# EAGLE schematic extension_board_header_xbee (EAGLE 7.1.0)
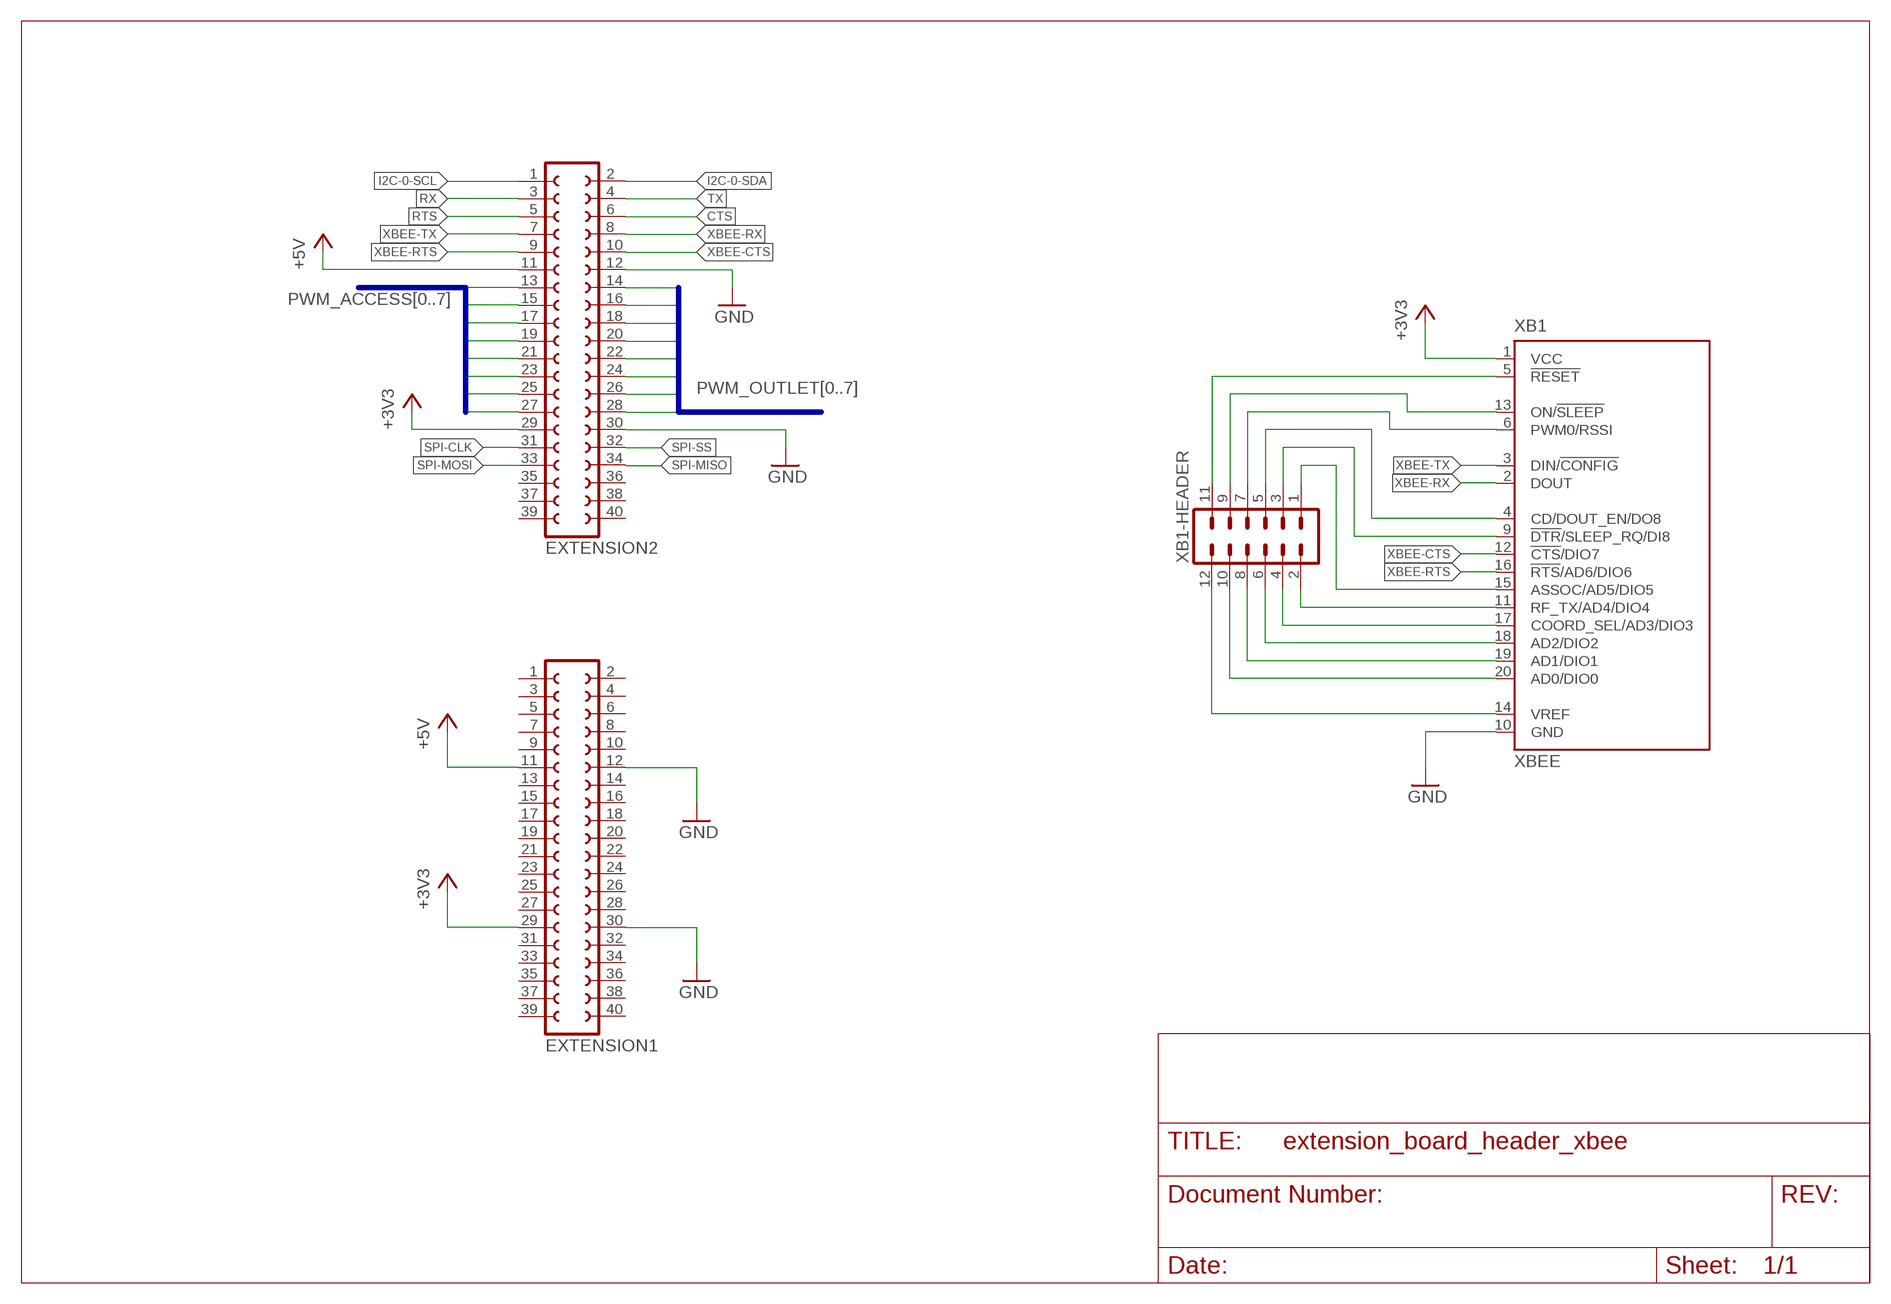
[diagram p0: schematic, sheet 1]

## Parts
EXTENSION1  FE20-2  [FE20-2]
EXTENSION2  FE20-2  [FE20-2]
XB1  XBEE  [XBEE]
XB1-HEADER  MA06-2  [MA06-2]

## Nets
+3V3: EXTENSION1.29 EXTENSION2.29 XB1.1(VCC)
+5V: EXTENSION1.11 EXTENSION2.11
CTS: EXTENSION2.6
GND: EXTENSION1.12 EXTENSION1.30 EXTENSION2.12 EXTENSION2.30 XB1.10(GND)
I2C-0-SCL: EXTENSION2.1
I2C-0-SDA: EXTENSION2.2
N$3: XB1-HEADER.12 XB1.14(VREF)
N$4: XB1-HEADER.10 XB1.20(AD0/DIO0)
N$5: XB1-HEADER.8 XB1.19(AD1/DIO1)
N$6: XB1-HEADER.6 XB1.18(AD2/DIO2)
N$7: XB1-HEADER.4 XB1.17(COORD_SEL/AD3/DIO3)
N$8: XB1-HEADER.2 XB1.11(RF_TX/AD4/DIO4)
N$9: XB1-HEADER.3 XB1.9(!DTR!/SLEEP_RQ/DI8)
N$10: XB1-HEADER.5 XB1.4(CD/DOUT_EN/DO8)
N$11: XB1-HEADER.7 XB1.6(PWM0/RSSI)
N$12: XB1-HEADER.9 XB1.13(ON/!SLEEP)
N$13: XB1-HEADER.11 XB1.5(!RESET)
N$14: XB1-HEADER.1 XB1.15(ASSOC/AD5/DIO5)
PWM_ACCESS0: EXTENSION2.13
PWM_ACCESS1: EXTENSION2.15
PWM_ACCESS2: EXTENSION2.17
PWM_ACCESS3: EXTENSION2.19
PWM_ACCESS4: EXTENSION2.21
PWM_ACCESS5: EXTENSION2.23
PWM_ACCESS6: EXTENSION2.25
PWM_ACCESS7: EXTENSION2.27
PWM_OUTLET0: EXTENSION2.14
PWM_OUTLET1: EXTENSION2.16
PWM_OUTLET2: EXTENSION2.18
PWM_OUTLET3: EXTENSION2.20
PWM_OUTLET4: EXTENSION2.22
PWM_OUTLET5: EXTENSION2.24
PWM_OUTLET6: EXTENSION2.26
PWM_OUTLET7: EXTENSION2.28
RTS: EXTENSION2.5
RX: EXTENSION2.3
SPI-CLK: EXTENSION2.31
SPI-MISO: EXTENSION2.34
SPI-MOSI: EXTENSION2.33
SPI-SS: EXTENSION2.32
TX: EXTENSION2.4
XBEE-CTS: EXTENSION2.10 XB1.12(!CTS!/DIO7)
XBEE-RTS: EXTENSION2.9 XB1.16(!RTS!/AD6/DIO6)
XBEE-RX: EXTENSION2.8 XB1.2(DOUT)
XBEE-TX: EXTENSION2.7 XB1.3(DIN/!CONFIG)
Unconnected: EXTENSION1.1 EXTENSION1.2 EXTENSION1.3 EXTENSION1.4 EXTENSION1.5 EXTENSION1.6 EXTENSION1.7 EXTENSION1.8 EXTENSION1.9 EXTENSION1.10 EXTENSION1.13 EXTENSION1.14 EXTENSION1.15 EXTENSION1.16 EXTENSION1.17 EXTENSION1.18 EXTENSION1.19 EXTENSION1.20 EXTENSION1.21 EXTENSION1.22 EXTENSION1.23 EXTENSION1.24 EXTENSION1.25 EXTENSION1.26 EXTENSION1.27 EXTENSION1.28 EXTENSION1.31 EXTENSION1.32 EXTENSION1.33 EXTENSION1.34 EXTENSION1.35 EXTENSION1.36 EXTENSION1.37 EXTENSION1.38 EXTENSION1.39 EXTENSION1.40 EXTENSION2.35 EXTENSION2.36 EXTENSION2.37 EXTENSION2.38 EXTENSION2.39 EXTENSION2.40

## Buses
PWM_ACCESS[0..7]
PWM_OUTLET[0..7]

## Library data of the parts
EXTENSION1 EXTENSION2 = con-lsta:FE20-2: FEMALE HEADER; OC_FARNELL: unknown; OC_NEWARK: unknown
XB1 = maxstream:XBEE: XBee (TM) /XBee-PRO(TM) OEM RF Modules Source: MaxStream, Inc. xbee_productmanual.pdf; MPN: XBP24-Z7UIT-004; OC_FARNELL: 1751799; OC_NEWARK: 34R5507
XB1-HEADER = con-lstb:MA06-2: PIN HEADER; OC_FARNELL: unknown; OC_NEWARK: unknown